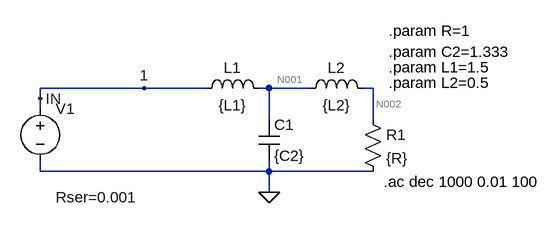
[diagram p0: schematic ej_2_ts7.asc]
ej_2_ts7.asc, the LTspice schematic file:
Version 4
SHEET 1 1460 680
WIRE -32 144 -192 144
WIRE 64 144 -32 144
WIRE 160 144 144 144
WIRE 224 144 160 144
WIRE 320 144 304 144
WIRE -192 160 -192 144
WIRE -192 176 -192 160
WIRE 160 192 160 144
WIRE 320 192 320 144
WIRE -192 272 -192 256
WIRE 160 272 160 256
WIRE 160 272 -192 272
WIRE 320 272 160 272
WIRE 160 304 160 272
FLAG -192 160 IN
FLAG -32 144 1
FLAG 160 304 0
SYMBOL voltage -192 160 R0
WINDOW 3 24 44 Invisible 2
WINDOW 39 24 152 Left 2
SYMATTR Value SINE(0 1 50)
SYMATTR SpiceLine Rser=0.001
SYMATTR Value2 AC 1
SYMATTR InstName V1
SYMBOL cap 144 192 R0
SYMATTR InstName C1
SYMATTR Value {C2}
SYMBOL res 304 176 R0
SYMATTR InstName R1
SYMATTR Value {R}
SYMBOL ind 48 160 R270
WINDOW 0 32 56 VTop 2
WINDOW 3 5 56 VBottom 2
SYMATTR InstName L1
SYMATTR Value {L1}
SYMBOL ind 208 160 R270
WINDOW 0 32 56 VTop 2
WINDOW 3 5 56 VBottom 2
SYMATTR InstName L2
SYMATTR Value {L2}
TEXT 336 288 Left 2 !.ac dec 1000 0.01 100
TEXT 344 56 Left 2 !.param R=1
TEXT 344 88 Left 2 !.param C2=1.333
TEXT 344 112 Left 2 !.param L1=1.5
TEXT 344 136 Left 2 !.param L2=0.5

The netlist it stands for:
* ej_2_ts7.asc
V1 1 0 SINE(0 1 50) AC 1 Rser=0.001
C1 N001 0 {C2}
R1 N002 0 {R}
L1 1 N001 {L1}
L2 N001 N002 {L2}
.ac dec 1000 0.01 100
.param R=1
.param C2=1.333
.param L1=1.5
.param L2=0.5
.backanno
.end

* Results of the author's LTspice run, read from the files saved beside the schematic
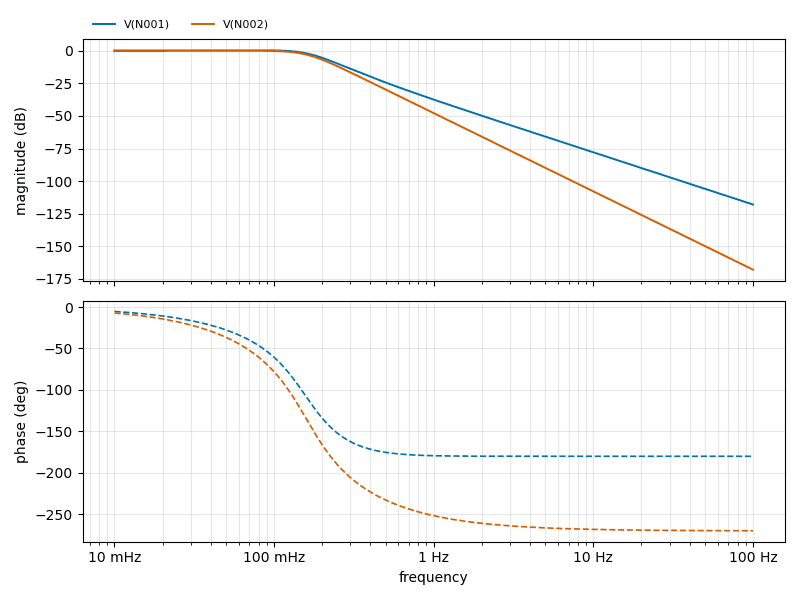
[diagram p1: AC Analysis of ej_2_ts7.asc, plotted from the saved traces]
* AC Analysis, 1 run:
*   V(N001): -0.01 dB at 10 mHz, -117.95 dB at 100 Hz, peak 0.19 dB at 84.92 mHz, 3 dB below the peak at 169.4 mHz
*   V(N002): -0.03 dB at 10 mHz, -167.89 dB at 100 Hz, peak -0.03 dB at 34.12 mHz, 3 dB below the peak at 159.3 mHz